# EAGLE design schematic (EAGLE 8.3.2)
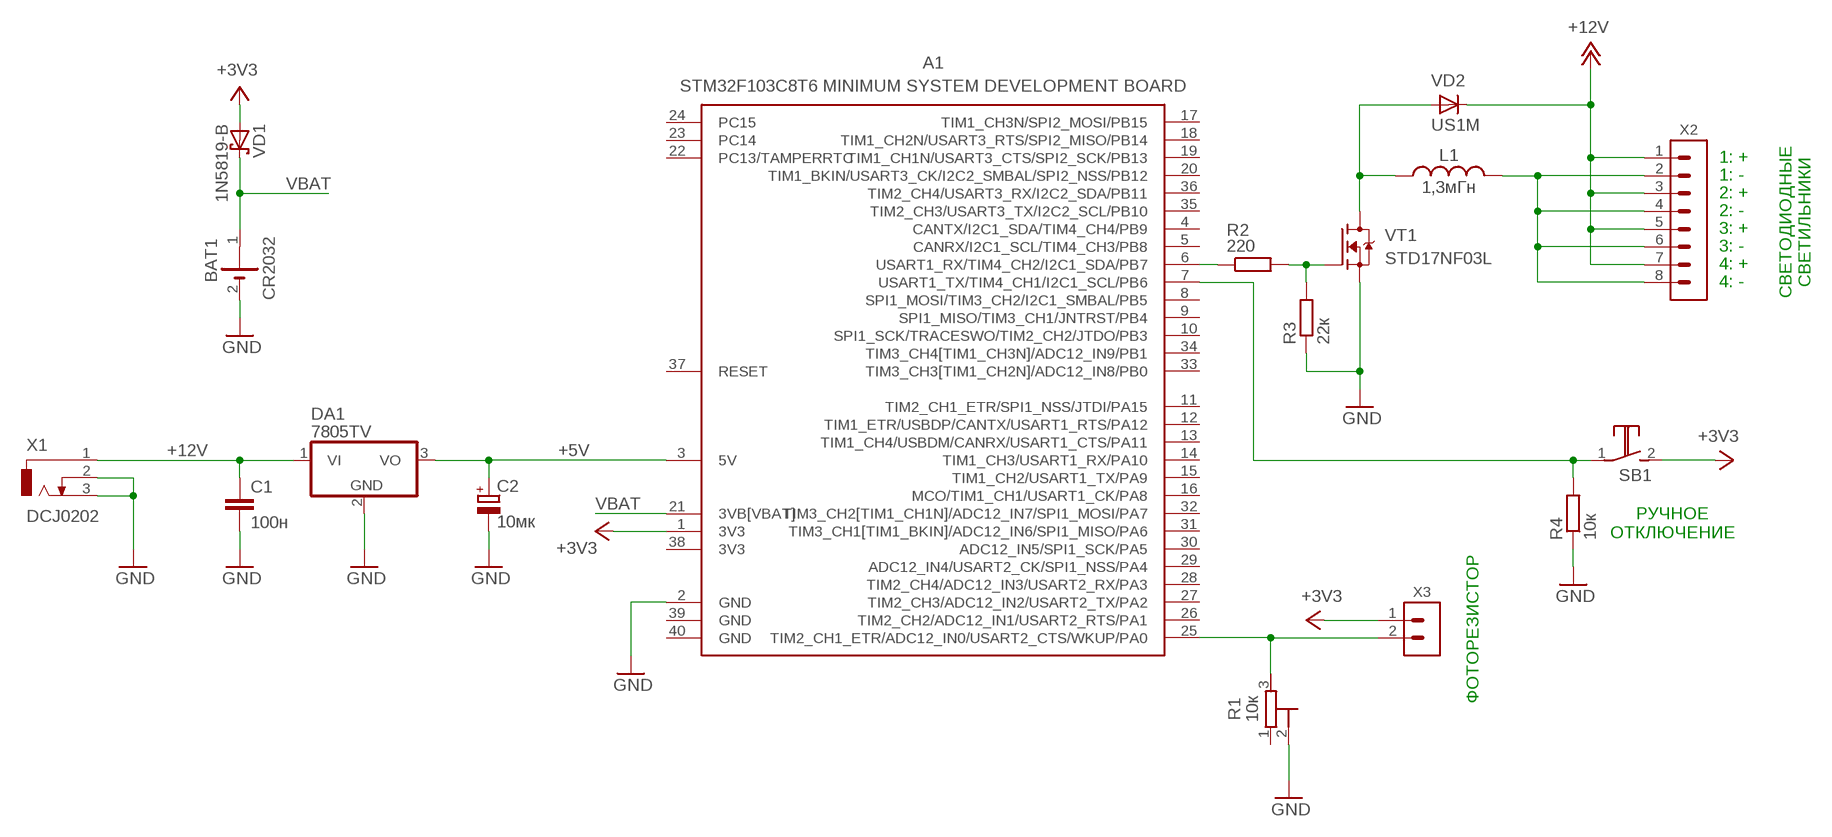
[diagram p0: schematic, sheet 1]

## Parts
A1  STM32F103C8T6_MINIMUM_SYSTEM_DEVELOPMENT_BOARD  [STM32F103C8T6_MINIMUM_SYSTEM_DEVELOPMENT_BOARD]
BAT1  CR2032  CR2032HOLDER  [CR2032HOLDER]
C1  100н  C-EU025-025X050  [C025-025X050]
C2  10мк  CPOL-EUE2-4  [E2-4]
DA1  7805TV  [TO220V]
L1  1,3мГн  INDUCTOR-2.5MH  [INDUCTOR-2.5MH]
R1  10к  TRIMMER  [TRIMMER]
R2  220  R-EU_0207/10  [0207/10]
R3  22к  R-EU_0207/10  [0207/10]
R4  10к  R-EU_0207/10  [0207/10]
SB1  PBS-10B-2  [PBS-10B-2]
VD1  1N5819-B  [DO41-7.6]
VD2  US1M  [DO-214AC]
VT1  STD17NF03L  [DPAK]
X1  DCJ0202  [DCJ0202]
X2  TERMINALS_BLOCK_8PIN  [TERMINALS_BLOCK_8PIN]
X3  TERMINALS_BLOCK_2PIN  [TERMINALS_BLOCK_2PIN]

## Nets
+3V3: A1.1(3V3) SB1.2(NO) VD1.A X3.1
+5V: A1.3(5V) C2.+ DA1.3(VO)
+12V: C1.1 DA1.1(VI) VD2.C X1.1 X2.1 X2.3 X2.5 X2.7
DRAIN: L1.1 VD2.A VT1.D
GND: A1.2(GND) BAT1.2(-) C1.2 C2.- DA1.2(GND) R1.2(S) R3.1 R4.1 VT1.S X1.2 X1.3
N$2: A1.7(USART1_TX/TIM4_CH1/I2C1_SCL/PB6) R4.2 SB1.1(COM)
N$4: R2.2 R3.2 VT1.G
N$5: L1.2 X2.2 X2.4 X2.6 X2.8
N$7: A1.25(TIM2_CH1_ETR/ADC12_IN0/USART2_CTS/WKUP/PA0) R1.3(E) X3.2
N$8: A1.6(USART1_RX/TIM4_CH2/I2C1_SDA/PB7) R2.1
VBAT: A1.21(3VB[VBAT]) BAT1.1(+) VD1.C
Unconnected: A1.4(CANTX/I2C1_SDA/TIM4_CH4/PB9) A1.5(CANRX/I2C1_SCL/TIM4_CH3/PB8) A1.8(SPI1_MOSI/TIM3_CH2/I2C1_SMBAL/PB5) A1.9(SPI1_MISO/TIM3_CH1/JNTRST/PB4) A1.10(SPI1_SCK/TRACESWO/TIM2_CH2/JTDO/PB3) A1.11(TIM2_CH1_ETR/SPI1_NSS/JTDI/PA15) A1.12(TIM1_ETR/USBDP/CANTX/USART1_RTS/PA12) A1.13(TIM1_CH4/USBDM/CANRX/USART1_CTS/PA11) A1.14(TIM1_CH3/USART1_RX/PA10) A1.15(TIM1_CH2/USART1_TX/PA9) A1.16(MCO/TIM1_CH1/USART1_CK/PA8) A1.17(TIM1_CH3N/SPI2_MOSI/PB15) A1.18(TIM1_CH2N/USART3_RTS/SPI2_MISO/PB14) A1.19(TIM1_CH1N/USART3_CTS/SPI2_SCK/PB13) A1.20(TIM1_BKIN/USART3_CK/I2C2_SMBAL/SPI2_NSS/PB12) A1.22(PC13/TAMPERRTC) A1.23(PC14) A1.24(PC15) A1.26(TIM2_CH2/ADC12_IN1/USART2_RTS/PA1) A1.27(TIM2_CH3/ADC12_IN2/USART2_TX/PA2) A1.28(TIM2_CH4/ADC12_IN3/USART2_RX/PA3) A1.29(ADC12_IN4/USART2_CK/SPI1_NSS/PA4) A1.30(ADC12_IN5/SPI1_SCK/PA5) A1.31(TIM3_CH1[TIM1_BKIN]/ADC12_IN6/SPI1_MISO/PA6) A1.32(TIM3_CH2[TIM1_CH1N]/ADC12_IN7/SPI1_MOSI/PA7) A1.33(TIM3_CH3[TIM1_CH2N]/ADC12_IN8/PB0) A1.34(TIM3_CH4[TIM1_CH3N]/ADC12_IN9/PB1) A1.35(TIM2_CH3/USART3_TX/I2C2_SCL/PB10) A1.36(TIM2_CH4/USART3_RX/I2C2_SDA/PB11) A1.37(RESET) R1.1(A)

## Notes on the sheet
- 1: +
- 1: -
- 2: +
- 2: -
- СВЕТОДИОДНЫЕ
  СВЕТИЛЬНИКИ
- 3: +
- 3: -
- 4: +
- 4: -
- РУЧНОЕ
  ОТКЛЮЧЕНИЕ
- ФОТОРЕЗИСТОР

## Power pins joined to a net without a drawn wire
3V3: A1.38(3V3)
GND: A1.39(GND) A1.40(GND)

## Library data of the parts
A1 = stm32:STM32F103C8T6_MINIMUM_SYSTEM_DEVELOPMENT_BOARD
BAT1 = battery-holders:CR2032HOLDER: LI BATTERY Varta
C1 = rcl:C-EU: CAPACITOR, European symbol
C2 = rcl:CPOL-EU: POLARIZED CAPACITOR, European symbol
DA1 = linear:78*: Positive VOLTAGE REGULATOR Source: http://cache.national.com/ds/LM/LM78L05.pdf http://www.fairchildsemi.com/ds/LM/LM7805.pdf
L1 = inductors:INDUCTOR-2.5MH
R1 = trimmers:TRIMMER
R2-R4 = rcl:R-EU_: RESISTOR, European symbol
SB1 = switches:PBS-10B-2: PBS-10B-2 or PBS-110 [OFF-(ON) / Normally open / Push On] https://www.chipdip.ru/product/pbs10b-2-black https://ru.aliexpress.com/item/10Pcs-7mm-Thread-Multicolor-2-Pins-Momentary-Push-Button-Switch-PBS-110-Red-Black-White-Blue/32812664953.html?spm=2114.13010608.0.0.2H3Nrn
VD1 = diode:1N581*: 1.0A SCHOTTKY BARRIER RECTIFIER Source: http://www.diodes.com/datasheets/ds23001.pdf
VD2 = diodes_smd:US1: Diodes US1 Series 1A UltraFast diodes Datasheet: diodes-datasheetsUS1.pdf <diodes-datasheets\US1.pdf> Description Part Number Diode, Fast, 1 A, 50 V US1A Diode, Fast, 1 A, 100 V US1B Diode, Fast, 1 A, 200 V US1D Diode, Fast, 1 A, 400 V US1G Diode, Fast, 1 A, 600 V US1J Diode, Fast, 1 A, 800 V US1K Diode, Fast, 1 A, 1,000 V US1M Features: • Glass passivated junction chip • For surface mounted application • Low profile package • Built-in strain relief • Ideal for automated placement • Easy pick and place • Ultrafast recovery time for high efficiency • Low forward voltage, low power loss • High temperature soldering guaranteed : 260°C/10 seconds on terminals • Plastic material; MPN: US1M; OC_FARNELL: 1625284; PACKAGE: DO-214AC; SUPPLIER: MULTICOMP; VOLTAGE: 1000
VT1 = transistors:STD17NF03L: STD17NF03L N-channel 30V - 0.038Ω - 17A - DPAK/IPAK STripFET™ II Power MOSFET Package: DPAK Datasheet: www.st.com/resource/en/datasheet/std17nf03l-1.pdf
X1 = con-jack:DCJ0202: DC POWER JACK Source: DCJ0202.pdf; OC_FARNELL: unknown; OC_NEWARK: unknown
X2 = connectors:TERMINALS_BLOCK_8PIN
X3 = connectors:TERMINALS_BLOCK_2PIN

## Board
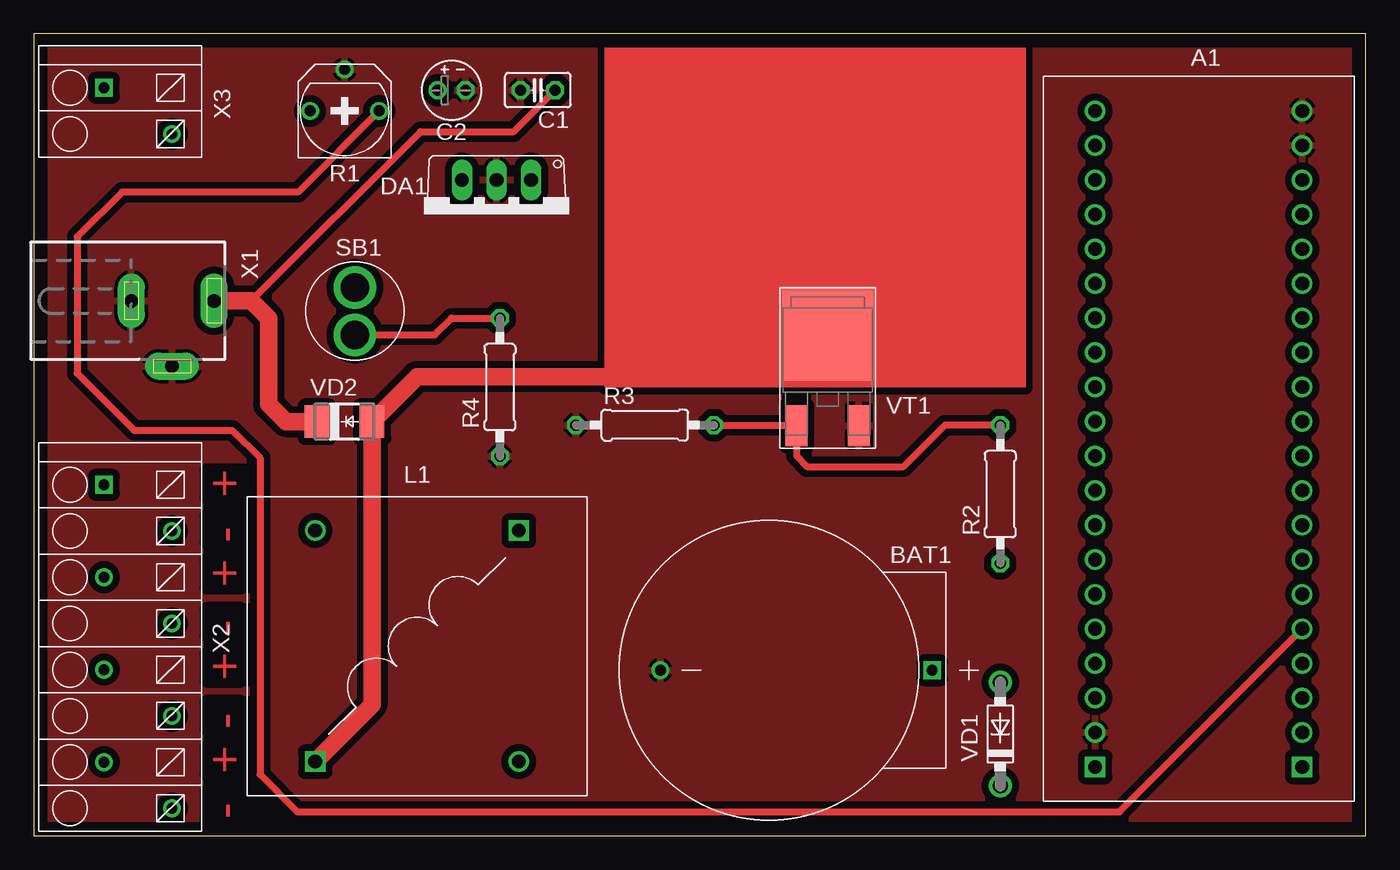
[diagram p1: board, top side]
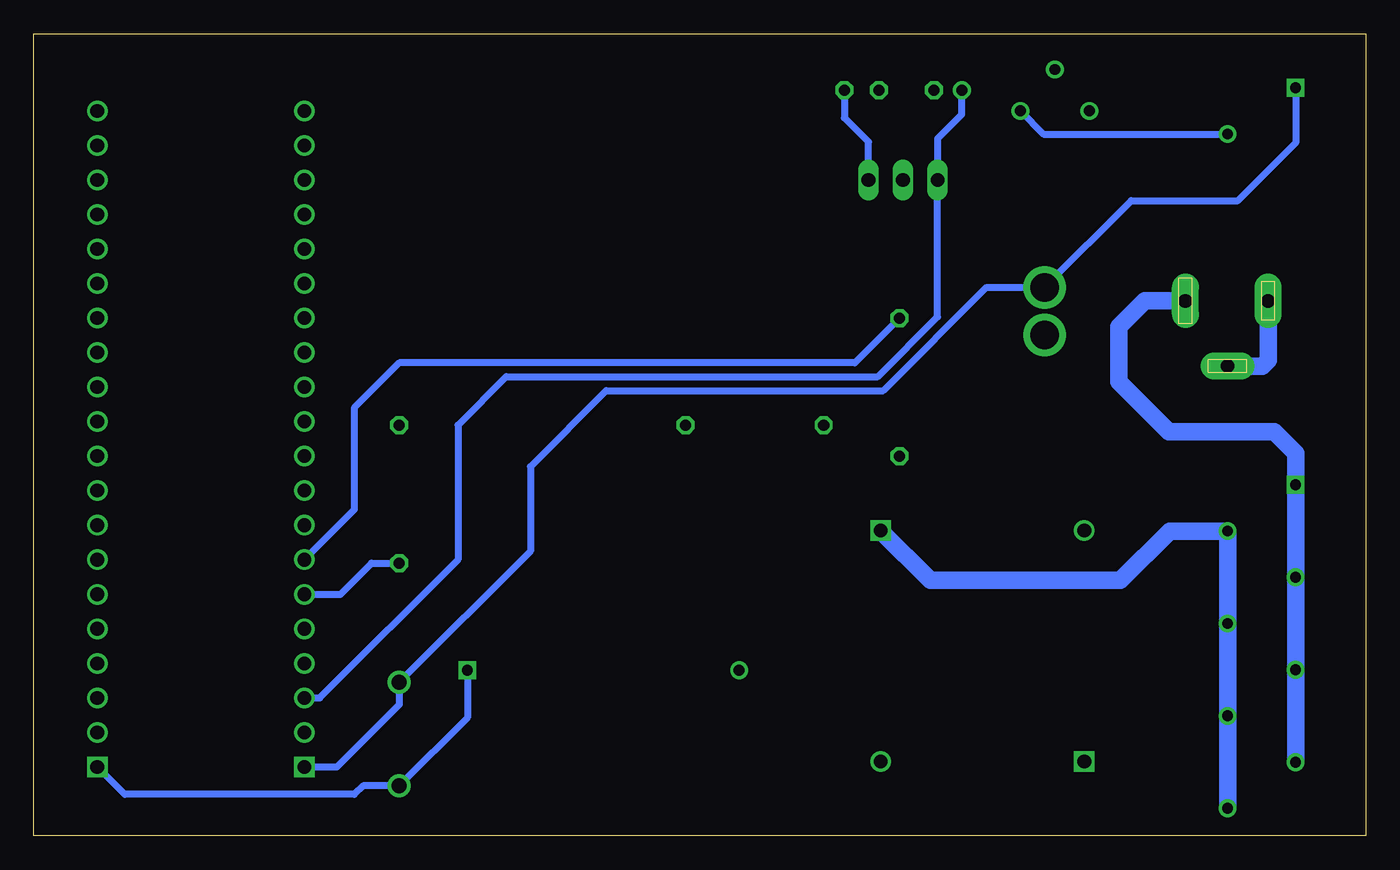
[diagram p2: board, bottom side, seen from below]

Size 98 x 59 mm. Coordinates in mm from the lower left corner, seen from the top.
Outline: 0,0 98,0 98,59 0,59 0,0
Copper layers (1*16): Top 0.035mm / dielectric 1.5mm / Bottom 0.035mm
Design rules "default *": minimum track width 20mil, minimum drill 0.6mm, track to track 20mil, track to pad 20mil, pad to pad 20mil, via to via 6mil, smd to smd 20mil, copper to edge 40mil, drill to drill 6mil, minimum pad ring 10mil, minimum via ring 8mil, stop-mask expansion 4mil, vias tented up to drill 0mil, thermal gap 10mil

### Footprints (pad centres in the part's own frame; a part is rotated, then mirrored left to right if it is on the bottom)
STM32F103C8T6_MINIMUM_SYSTEM_DEVELOPMENT_BOARD = drill 1 square: 1 -7.62,-24.13; 21 7.62,-24.13 | drill 1: 2 -7.62,-21.59; 3 -7.62,-19.05; 4 -7.62,-16.51; 5 -7.62,-13.97; 6 -7.62,-11.43; 7 -7.62,-8.89; 8 -7.62,-6.35; 9 -7.62,-3.81; 10 -7.62,-1.27; 11 -7.62,1.27; 12 -7.62,3.81; 13 -7.62,6.35; 14 -7.62,8.89; 15 -7.62,11.43; 16 -7.62,13.97; 17 -7.62,16.51; 18 -7.62,19.05; 19 -7.62,21.59; 20 -7.62,24.13; 22 7.62,-21.59; 23 7.62,-19.05; 24 7.62,-16.51; 25 7.62,-13.97; 26 7.62,-11.43; 27 7.62,-8.89; 28 7.62,-6.35; 29 7.62,-3.81; 30 7.62,-1.27; 31 7.62,1.27; 32 7.62,3.81; 33 7.62,6.35; 34 7.62,8.89; 35 7.62,11.43; 36 7.62,13.97; 37 7.62,16.51; 38 7.62,19.05; 39 7.62,21.59; 40 7.62,24.13
CR2032HOLDER = drill 0.8 square: 1 12,0 | drill 0.8: 2 -8,0
C025-025X050 = drill 0.813 octagon: 1 -1.27,0; 2 1.27,0
E2-4 = drill 0.813 pad 1.27: + -1.016,0 | drill 0.813 pad 1.27 octagon: - 1.016,0
TO220V = drill 1.016 long: 1 -2.54,-2.54; 2 0,-2.54; 3 2.54,-2.54
INDUCTOR-2.5MH = drill 1 square: 1 -7.5,-8.5; 2 7.5,8.5 | drill 1: 3 -7.5,8.5; 4 7.5,-8.5
TRIMMER = drill 0.8: 1 -2.54,0; 2 0,3.048; 3 2.54,0
0207/10 = drill 0.813 octagon: 1 -5.08,0; 2 5.08,0
PBS-10B-2 = drill 2.1: 1 0,-1.75; 2 0,1.75
DO41-7.6 = drill 1.1 pad 1.7: A 3.81,0; C -3.81,0
DO-214AC = smd 1.8 x 2.4: A 2.025,0; C -2.025,0
DPAK = smd 6.7 x 6.7: D 0,0 | smd 1.6 x 3: G -2.3,-6.65; S 2.3,-6.65
DCJ0202 = drill 1 pad 2 long: 1 0,3.1; 2 4.8,0; 3 0,-3
TERMINALS_BLOCK_8PIN = drill 0.8 square: 1 -1.7,-1.2 | drill 0.8: 2 1.7,3.8; 3 5.1,-1.2; 4 8.5,3.8; 5 11.9,-1.2; 6 15.3,3.8; 7 18.7,-1.2; 8 22.1,3.8
TERMINALS_BLOCK_2PIN = drill 0.8 square: 1 -1.7,-1.2 | drill 0.8: 2 1.7,3.8

### Placement (x,y rotation side)
A1  85.72,29.21 0 top
BAT1  54.1,12.19 0 top
C1  37.08,54.86 180 top
C2  30.73,54.86 0 top
DA1  34.04,45.72 180 top
L1  28.19,13.97 0 top
R1  22.86,53.34 0 top
R2  71.12,25.15 90 top
R3  44.96,30.23 0 top
R4  34.29,33.02 90 top
SB1  23.62,38.61 0 top
VD1  71.12,7.49 90 top
VD2  22.86,30.48 0 top
VT1  58.42,36.83 0 top
X1  10.16,39.37 270 top
X2  6.35,24.13 270 top
X3  6.35,53.34 270 top

### Tracks (layer width: path | path; a pad name or v marks a point on that pad's centre or on a via)
+3V3
  Bottom 0.508: A1.1 75.69,5.08 71.12,9.65 VD1.A 61.47,20.95 61.47,27.18 55.88,32.77 35.48,32.77 27.89,40.36 SB1.2 17.24,46.74 9.4,46.74 5.15,50.98 X3.1
+5V
  Bottom 0.508: A1.3 76.96,10.16 66.8,20.32 66.8,30.23 63.25,33.78 35.9,33.78 31.5,38.19 DA1.3 31.5,51.31 29.72,53.09 C2.+
+12V
  Top 0.508: C1.1 35.31,51.82 28.45,51.82 16,39.37
  Top 1.27: X1.1 16,39.37 17.27,38.1 17.27,31.75 18.54,30.48 VD2.C
  Bottom 0.508: C1.1 38.35,52.83 36.58,51.05 DA1.1
  Bottom 1.27: X2.7 X2.5 X2.3 X2.1 5.15,28.14 6.73,29.72 14.48,29.72 18.16,33.4 18.16,37.47 16.26,39.37 X1.1
DRAIN
  Top 1.27: L1.1 24.89,9.66 VD2.A 28.19,33.78 49.53,33.78 52.58,36.83 VT1.D
GND
  Bottom 1.27: X1.3 7.16,35 7.59,34.57 X1.2
  pour Top: 0,59 0,0 98,0 98,59
N$2
  Top 0.508: R4.2 30.73,38.1 29.49,36.86 SB1.1
  Bottom 0.508: R4.2 37.59,34.8 71.12,34.8 74.42,31.5 74.42,24 A1.7
N$4
  Top 0.508: R2.2 67.06,30.23 64.01,27.18 56.9,27.18 56.12,27.95 VT1.G 56.07,30.23 R3.2
N$5
  Bottom 1.27: X2.8 X2.6 X2.4 X2.2 14.4,22.43 18.03,18.8 32.02,18.8 L1.2
N$7
  Top 0.508: A1.25 79.88,1.78 19.38,1.78 16.64,4.52 16.64,27.81 14.61,29.84 7.37,29.84 3.17,34.04 3.17,44.07 6.48,47.37 19.43,47.37 R1.3
  Bottom 0.508: R1.3 23.7,51.64 X3.2
N$8
  Bottom 0.508: R2.1 73.15,20.07 75.44,17.78 A1.6
VBAT
  Bottom 0.508: A1.21 91.31,3.05 74.42,3.05 73.79,3.68 VD1.C 66.1,8.7 BAT1.1
(copper drawn outside any net)
  shapes: Top area x1

### Text on the board
Top: + | - | + | - | + | - | + | -